# Altium schematic sheet TopSheet.SchDoc
size A4; CompanyName: Technische Hochschule Nürnberg Georg Simon Ohm; Address1: Fürther Straße 250; Address2: 90429 Nürnberg; Address3: GERMANY; SheetNumber: 1; SheetTotal: 6; CompanyName2: Institut ELSYS
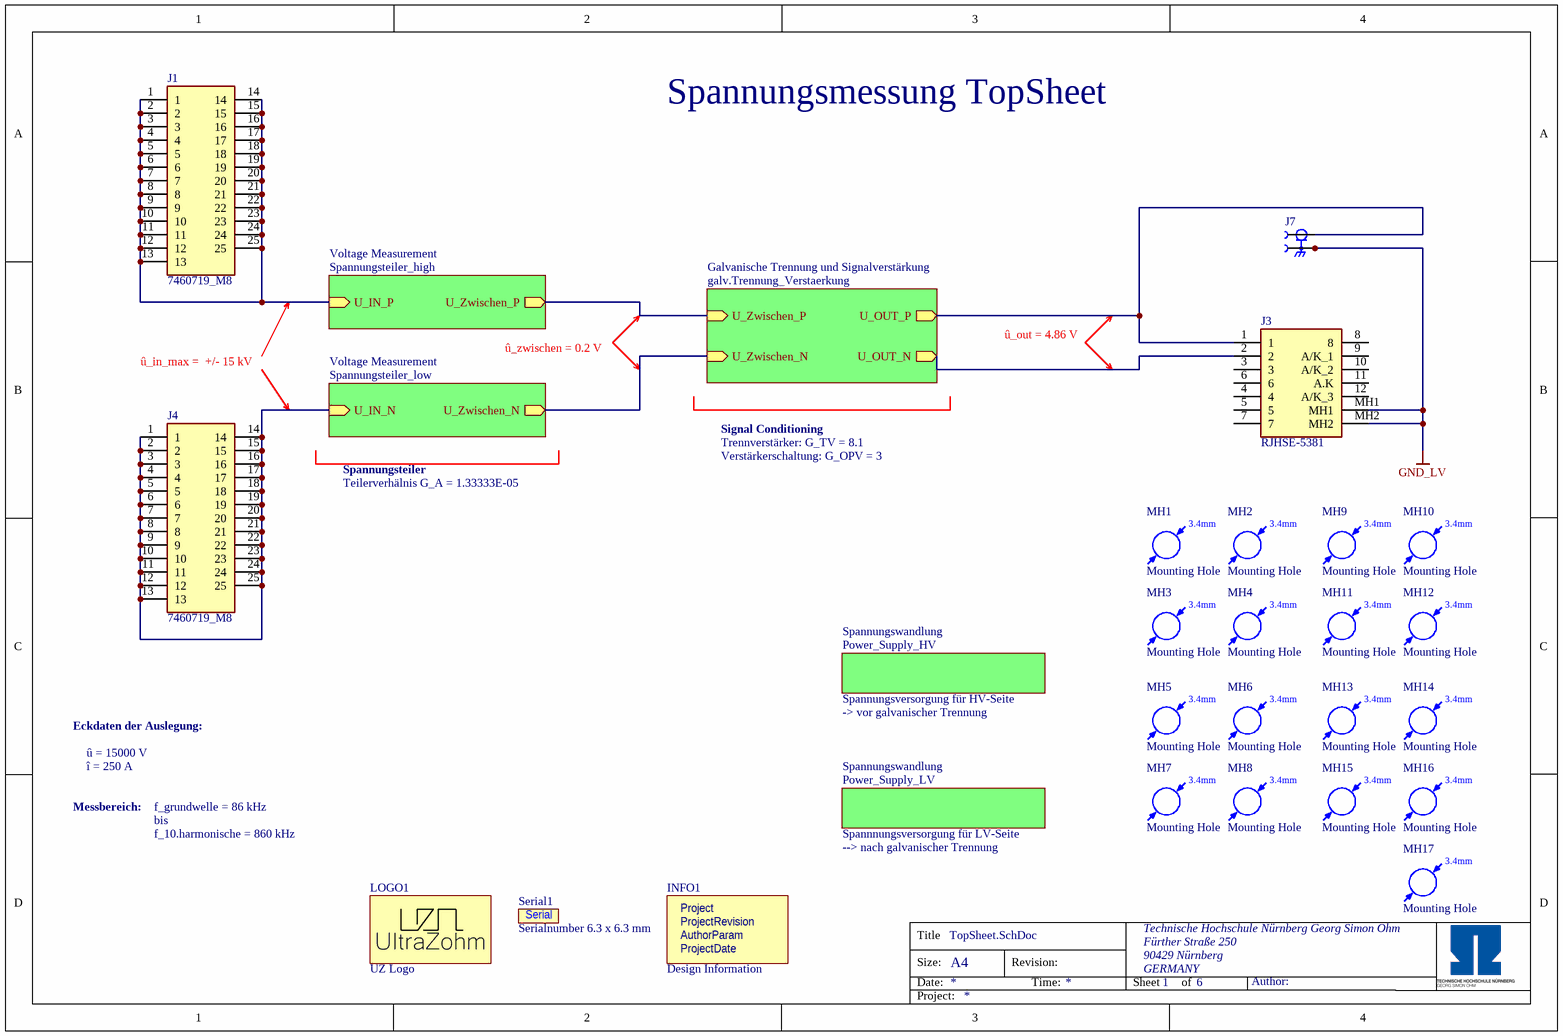
[diagram p0: TopSheet.SchDoc]

## Parts
INFO1  Design Information  [Design_info]  (no BOM)
J1  7460719_M8  [7460719]
J3  RJHSE-5381  [RJHSE5381]
J4  7460719_M8  [7460719]
J7  BNC5-J-P-GN-ST-TH2D_new  [BNC5-J-P-GN-ST-TH2D_new]  (value not drawn)
LOGO1  UZ Logo  [UZ_Logo_small]  (no BOM)
MH1  Mounting Hole  [MH_3.4]
MH2  Mounting Hole  [MH_3.4]
MH3  Mounting Hole  [MH_3.4]
MH4  Mounting Hole  [MH_3.4]
MH5  Mounting Hole  [MH_3.4]
MH6  Mounting Hole  [MH_3.4]
MH7  Mounting Hole  [MH_3.4]
MH8  Mounting Hole  [MH_3.4]
MH9  Mounting Hole  [MH_3.4]
MH10  Mounting Hole  [MH_3.4]
MH11  Mounting Hole  [MH_3.4]
MH12  Mounting Hole  [MH_3.4]
MH13  Mounting Hole  [MH_3.4]
MH14  Mounting Hole  [MH_3.4]
MH15  Mounting Hole  [MH_3.4]
MH16  Mounting Hole  [MH_3.4]
MH17  Mounting Hole  [MH_3.4]
Serial1  Serialnumber 6.3 x 6.3 mm  [SERIAL_6.3X6.3MM]  (no BOM)

## Sub-sheets
Galvanische Trennung und Signalverstärkung = galv.Trennung_Verstaerkung: U_Zwischen_P (in), U_Zwischen_N (in), U_OUT_N (out), U_OUT_P (out)
Spannungswandlung = Power_Supply_LV: no entries
Spannungswandlung = Power_Supply_HV: no entries
Voltage Measurement = Spannungsteiler_high: U_IN_P (in), U_Zwischen_P (out)
Voltage Measurement = Spannungsteiler_low: U_IN_N (in), U_Zwischen_N (out)

## Nets
GND_LV: J3.MH1 J3.MH2 J7.S_1 J7.S_2 J7.S_3
NetJ1_1: J1.1 J1.2 J1.3 J1.4 J1.5 J1.6 J1.7 J1.8 J1.9 J1.10 J1.11 J1.12 J1.13 J1.14 J1.15 J1.16 J1.17 J1.18 J1.19 J1.20 J1.21 J1.22 J1.23 J1.24 J1.25 ; sheet Voltage Measurement/U_IN_P
NetJ3_1: J3.1 J7.1 ; sheet Galvanische Trennung und Signalverstärkung/U_OUT_P
NetJ3_2: J3.2 ; sheet Galvanische Trennung und Signalverstärkung/U_OUT_N
NetJ4_1: J4.1 J4.2 J4.3 J4.4 J4.5 J4.6 J4.7 J4.8 J4.9 J4.10 J4.11 J4.12 J4.13 J4.14 J4.15 J4.16 J4.17 J4.18 J4.19 J4.20 J4.21 J4.22 J4.23 J4.24 J4.25 ; sheet Voltage Measurement/U_IN_N
(unnamed): sheet Voltage Measurement/U_Zwischen_P, sheet Galvanische Trennung und Signalverstärkung/U_Zwischen_P
(unnamed): sheet Galvanische Trennung und Signalverstärkung/U_Zwischen_N, sheet Voltage Measurement/U_Zwischen_N

Not connected (* = marked no-connect by the designer): J3 3 4 5 6 7 8 9(A/K_1) 10(A/K_2) 11(A.K) 12(A/K_3)

## Notes on the sheet
- Spannungsmessung TopSheet
- û_in_max =  +/- 15 kV
- û_zwischen = 0.2 V
- û_out = 4.86 V
- Signal Conditioning
- Trennverstärker: G_TV = 8.1
- Spannungsteiler
- Teilerverhälnis G_A = 1.33333E-05
- Verstärkerschaltung: G_OPV = 3
- Spannungsversorgung für HV-Seite
- -> vor galvanischer Trennung
- Eckdaten der Auslegung:
- î = 250 A
- û = 15000 V
- Messbereich:
- f_grundwelle = 86 kHz
- f_10.harmonische = 860 kHz
- bis
- Spannnungsversorgung für LV-Seite
- --> nach galvanischer Trennung
- Title
- Size:
- Date:
- A4
- Revision:
- Time:
- Sheet
- of
- Author:
- Project:
- (in symbol Design Information) Project; ProjectRevision; AuthorParam; ProjectDate
- (in symbol Mounting Hole) 3.4mm
- (in symbol Serial Number) Serial

## Library data of the parts
INFO1 = Design Information: Design InformationS; Manufacturer: UltraZohm; Created from: MGremer; Manufacturer Part Number: Design Information; PartID: 12; Created On: 03.11.2021 09:04:23; ComponentLink1Description: https://docs.ultrazohm.com/; ComponentLink1URL: homepage; Component Type: Design Information; Last Updated: 03.11.2021 09:28:34; Supplier 1: -; Supplier Part Number 1: -; Type: Design Information; Value: Design Information; Live Cycle Status: 1
J1 J4 = 7460719_M8: Connector; Manufacturer_Name: Wurth Elektronik; Datasheet Link: https://www.mouser.com/datasheet/2/445/7460719-1723637.pdf; Height: 20.5mm; Manufacturer_Part_Number: 7460719; Mouser Part Number: 710-7460719; Mouser Price/Stock: https://www.mouser.co.uk/ProductDetail/Wurth-Elektronik/7460719?qs=lykWx4dhCCHoCGzpKhOnqA%3D%3D; Supplier 1: Mouser; Supplier Part Number 1: 710-7460719
J3 = RJHSE-5381: CAT5, RJ45 Connector, 1 port; Manufacturer: Amphenol; Created from: DHufnagel; Manufacturer Part Number: RJHSE-5381; PartID: 5; Created On: 14.06.2022 08:36:24; ComponentLink1Description: Datasheet; ComponentLink1URL: https://www.mouser.de/datasheet/2/18/1/io_modjack_rjhse-2509079.pdf; ComponentLink2Description: Drawing; ComponentLink2URL: https://cdn.amphenol-cs.com/media/wysiwyg/files/drawing/rjhsex38x.pdf; Component Type: RJ45 Connector; Device Package: RJ45; Last Updated: 14.06.2022 08:36:42; Mounting Type: THT; Series: RJHSE; Supplier 1: Mouser; Supplier Part Number 1: 523-RJHSE-5381; Type: RJ45 Connector; Live Cycle Status: 1; Stock number: not stored
J7 = BNC5-J-P-GN-ST-TH2D_new: BNC Connector; Supplier 1: Mouser; Supplier Part Number 1: 200-BNC5JPGNSTTH2D
LOGO1 = Logo small: Manufacturer: UltraZohm; Created from: MGremer; Created: Jan2021_Liegmann; Value: Logo; Manufacturer Part Number: Logo small; PartID: 10; Created On: 03.11.2021 09:04:23; ComponentLink1Description: https://docs.ultrazohm.com/; ComponentLink1URL: homepage; Component Type: Logo; Last Updated: 03.11.2021 09:05:50; Supplier 1: -; Supplier Part Number 1: -; Type: Logo; Live Cycle Status: 1
MH1-MH17 = Mounting Hole: Created from: MHlatky; Manufacturer Part Number: Mounting Hole; PartID: 16; Created On: 26.01.2021 09:19:51; ComponentLink1Description: Datasheet; Component Type: Mounting Hole; Device Package: -; Last Updated: 21.03.2022 23:05:12; Manufacturer: Mounting Hole; Supplier 1: Mounting Hole; Supplier Part Number 1: Mounting Hole; Type: Mounting Hole; Value: Mounting Hole; Live Cycle Status: 1; Stock number: not stored
Serial1 = Serial Number: Manufacturer: UltraZohm; Value: REV; Created from: MGremer; Created: 2018_09_18_AGeiger; Manufacturer Part Number: Serial Number; PartID: 11; Created On: 03.11.2021 09:04:23; ComponentLink1Description: https://docs.ultrazohm.com/; ComponentLink1URL: homepage; Component Type: Serial Number; Last Updated: 03.11.2021 09:28:34; Supplier 1: -; Supplier Part Number 1: -; Type: Serial Number; Live Cycle Status: 1